# EAGLE design tram.stop (EAGLE 6.5.0)
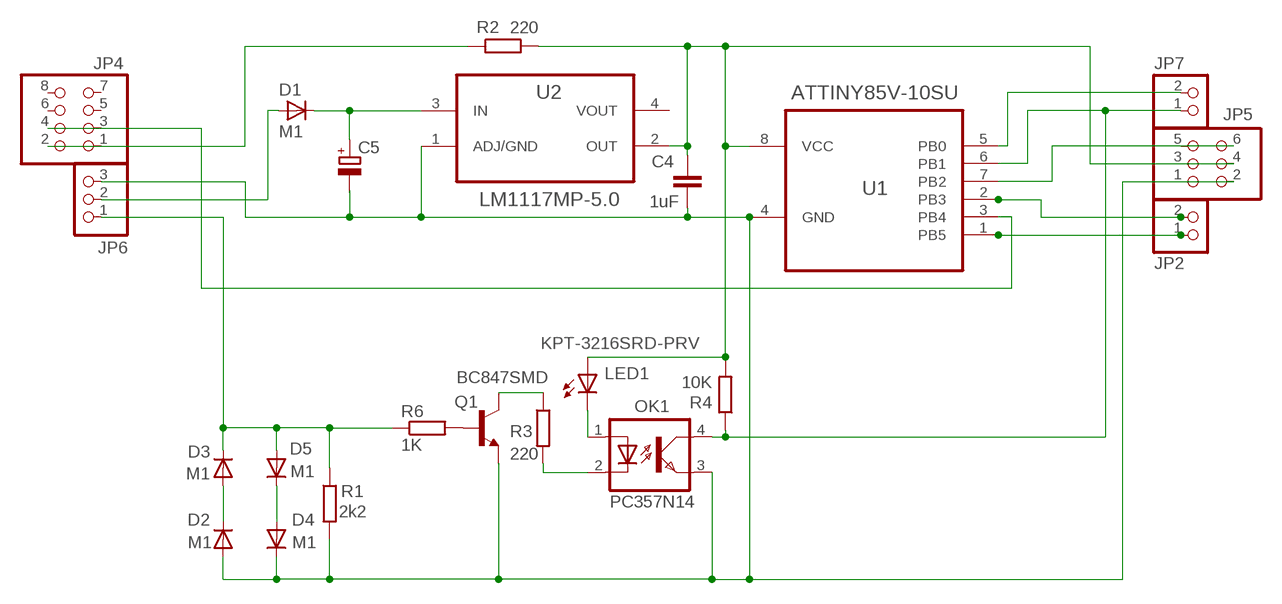
[diagram p0: schematic, sheet 1]

## Parts
C4  1uF  C-EUC0402  [C0402]
C5  CPOL-EUSMCD  [SMC_D]
D1  M1  ES2D  [SMB]
D2  M1  ES2D  [SMB]
D3  M1  ES2D  [SMB]
D4  M1  ES2D  [SMB]
D5  M1  ES2D  [SMB]
JP2  PINHD-1X2/90  [1X02/90]
JP4  PINHD-2X4/90  [2X04/90]
JP5  PINHD-2X3/90  [2X03/90]
JP6  PINHD-1X3/90  [1X03/90]
JP7  PINHD-1X2/90  [1X02/90]
LED1  KPT-3216SRD-PRV  LEDSML1206  [SML1206]
OK1  PC357N14  LTV816S  [SMD4]
Q1  BC847SMD  [SOT23]
R1  2k2  R-EU_R1206  [R1206]
R2  220  R-EU_R1206  [R1206]
R3  220  R-EU_R1206  [R1206]
R4  10K  R-EU_R1206  [R1206]
R6  1K  R-EU_R1206  [R1206]
U1  ATTINY85V-10SU  [SOIC127P798X216-8N]
U2  LM1117MP-5.0  [SOT230P696X180-4N]

## Nets
220: LED1.C OK1.1(A)
JP1: D3.C D5.A JP6.1 R1.1 R6.1
JP2: C4.2 D2.A D4.C JP5.1 JP5.2 JP6.3 OK1.3(EMIT) Q1.2(E) R1.2 U1.4(GND) U2.1(ADJ/GND)
N$1: JP2.1 U1.1(PB5)
N$2: JP2.2 U1.2(PB3)
N$4: D2.C D3.A
N$5: D4.A D5.C
N$6: Q1.1(B) R6.2
N$7: Q1.3(C) R3.1
N$9: OK1.2(C) R3.2
N$10: JP5.5 JP5.6 U1.7(PB2)
N$11: JP7.2 U1.5(PB0)
N$12: JP4.1 JP4.2 R2.1
N$14: JP7.1 OK1.4(COL) R4.1 U1.6(PB1)
N$15: C4.1 JP5.3 JP5.4 LED1.A R2.2 R4.2 U1.8(VCC) U2.2(OUT)
N$21: D1.A JP6.2
N$22: C5.+ D1.C U2.3(IN)
RED2: JP4.3 JP4.4 U1.3(PB4)
Unconnected: C5.- JP4.5 JP4.6 JP4.7 JP4.8 U2.4(VOUT)

## Library data of the parts
C4 = rcl:C-EU: CAPACITOR, European symbol
C5 = rcl:CPOL-EU: POLARIZED CAPACITOR, European symbol
D1-D5 = diode:ES2D: DIODE super fast rectifier, 2 A
JP2 JP7 = pinhead:PINHD-1X2: PIN HEADER
JP4 = pinhead:PINHD-2X4: PIN HEADER
JP5 = pinhead:PINHD-2X3: PIN HEADER
JP6 = pinhead:PINHD-1X3: PIN HEADER
LED1 = led:LED: LED OSRAM: - CHIPLED LG R971, LG N971, LY N971, LG Q971, LY Q971, LO R971, LY R971 LH N974, LH R974 LS Q976, LO Q976, LY Q976 LO Q996 - Hyper CHIPLED LW Q18S LB Q993, LB Q99A, LB R99A - SideLED LS A670, LO A670, LY A670, LG A670, LP A670 LB A673, LV A673, LT A673, LW A673 LH A674 LY A675 LS A676, LA A676, LO A676, LY A676, LW A676 LS A679, LY A679, LG A679 - Hyper Micro SIDELED® LS Y876, LA Y876, LO Y876, LY Y876 LT Y87S - SmartLED LW L88C, LW L88S LB L89C, LB L89S, LG L890 LS L89K, LO L89K, LY L89K LS L896, LA L896, LO L896, LY L896 - TOPLED LS T670, LO T670, LY T670, LG T670, LP T670 LSG T670, LSP T670, LSY T670, LOP T670, LYG T670 LG T671, LOG T671, LSG T671 LB T673, LV T673, LT T673, LW T673 LH T674 LS T676, LA T676, LO T676, LY T676, LB T676, LH T676, LSB T676, LW T676 LB T67C, LV T67C, LT T67C, LS T67K, LO T67K, LY T67K, LW E67C LS E67B, LA E67B, LO E67B, LY E67B, LB E67C, LV E67C, LT E67C LW T67C LS T679, LY T679, LG T679 LS T770, LO T770, LY T770, LG T770, LP T770 LB T773, LV T773, LT T773, LW T773 LH T774 LS E675, LA E675, LY E675, LS T675 LS T776, LA T776, LO T776, LY T776, LB T776 LHGB T686 LT T68C, LB T68C - Hyper Mini TOPLED® LB M676 - Mini TOPLED Santana® LG M470 LS M47K, LO M47K, LY M47K Source: http://www.osram.convergy.de LUXEON: - LUMILED® LXK2-PW12-R00, LXK2-PW12-S00, LXK2-PW14-U00, LXK2-PW14-V00 LXK2-PM12-R00, LXK2-PM12-S00, LXK2-PM14-U00 LXK2-PE12-Q00, LXK2-PE12-R00, LXK2-PE12-S00, LXK2-PE14-T00, LXK2-PE14-U00 LXK2-PB12-K00, LXK2-PB12-L00, LXK2-PB12-M00, LXK2-PB14-N00, LXK2-PB14-P00, LXK2-PB14-Q00 LXK2-PR12-L00, LXK2-PR12-M00, LXK2-PR14-Q00, LXK2-PR14-R00 LXK2-PD12-Q00, LXK2-PD12-R00, LXK2-PD12-S00 LXK2-PH12-R00, LXK2-PH12-S00 LXK2-PL12-P00, LXK2-PL12-Q00, LXK2-PL12-R00 Source: www.luxeon.com KINGBRIGHT: KA-3528ASYC Source: www.kingbright.com
OK1 = optocoupler:LTV816: OPTO COUPLER Source: LITEON, LTV816.pdf; OC_FARNELL: unknown; OC_NEWARK: unknown
Q1 = transistor-npn:BC847*: NPN Transistor
R1-R4 R6 = rcl:R-EU_: RESISTOR, European symbol
U1 = Attiny85:ATTINY85V-10SU: 8-bit Microcontroller with In-System Programmable Flash; MPN: ATTINY85V-10SU; OC_FARNELL: 1455166; OC_NEWARK: 58M3799; PACKAGE: SOIC-8; SUPPLIER: Atmel
U2 = LM1117:LM1117MP-5.0: Linear regulators; MPN: LM1117MP-5.0; OC_FARNELL: 9778209; OC_NEWARK: 41K3471; PACKAGE: SOT223-3; SUPPLIER: NationalSemiconductor

## Board
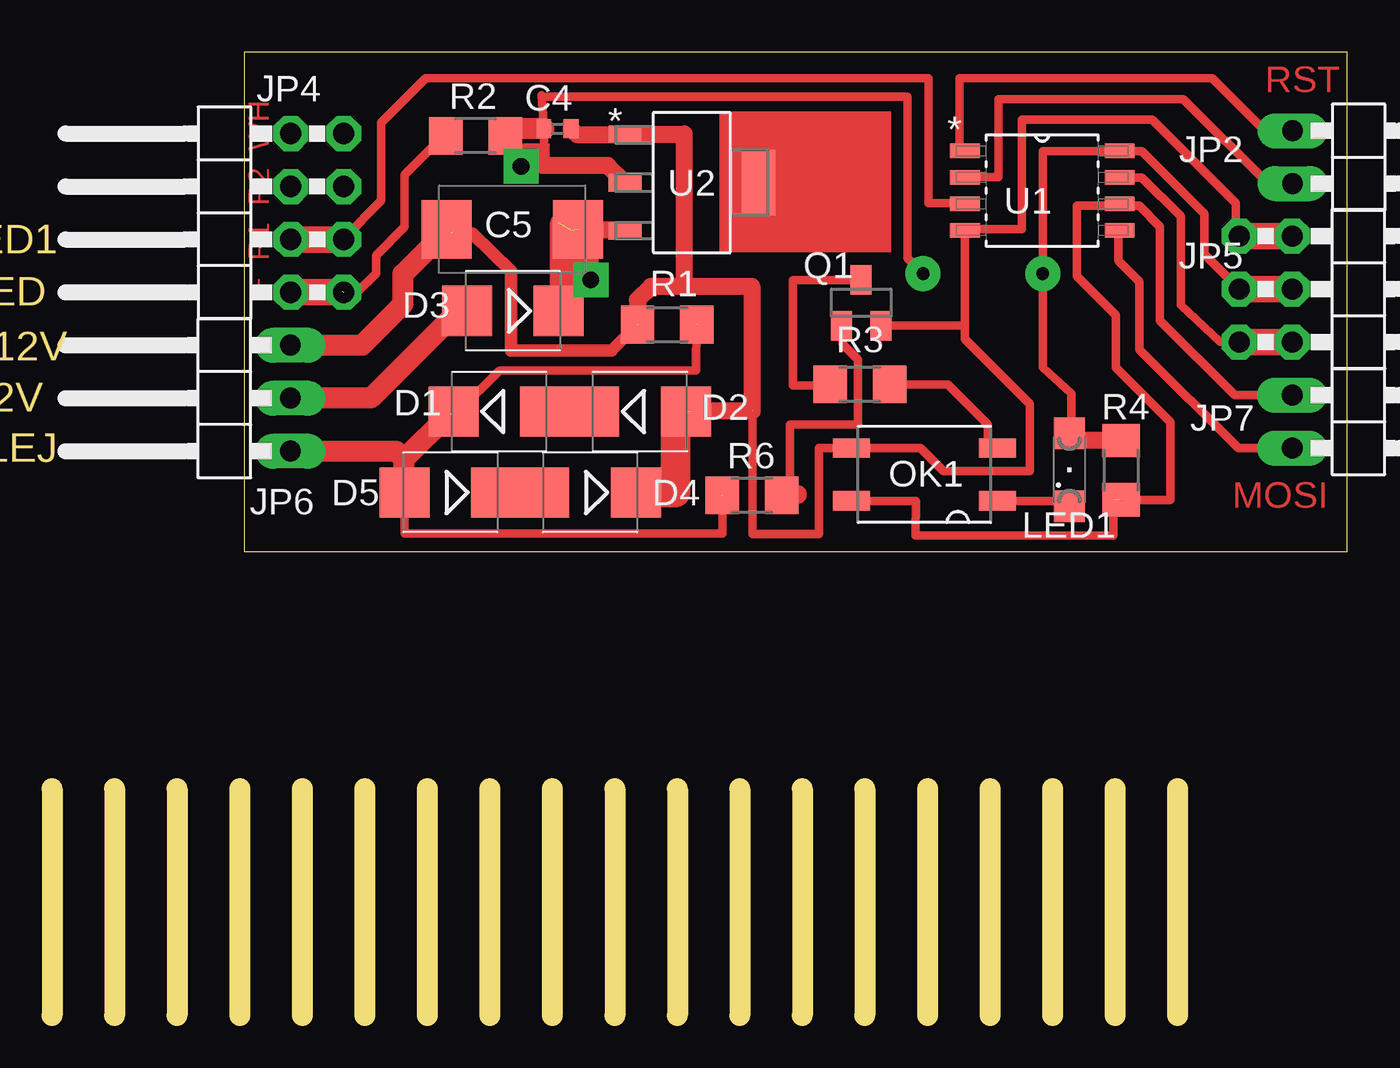
[diagram p1: board, top side]
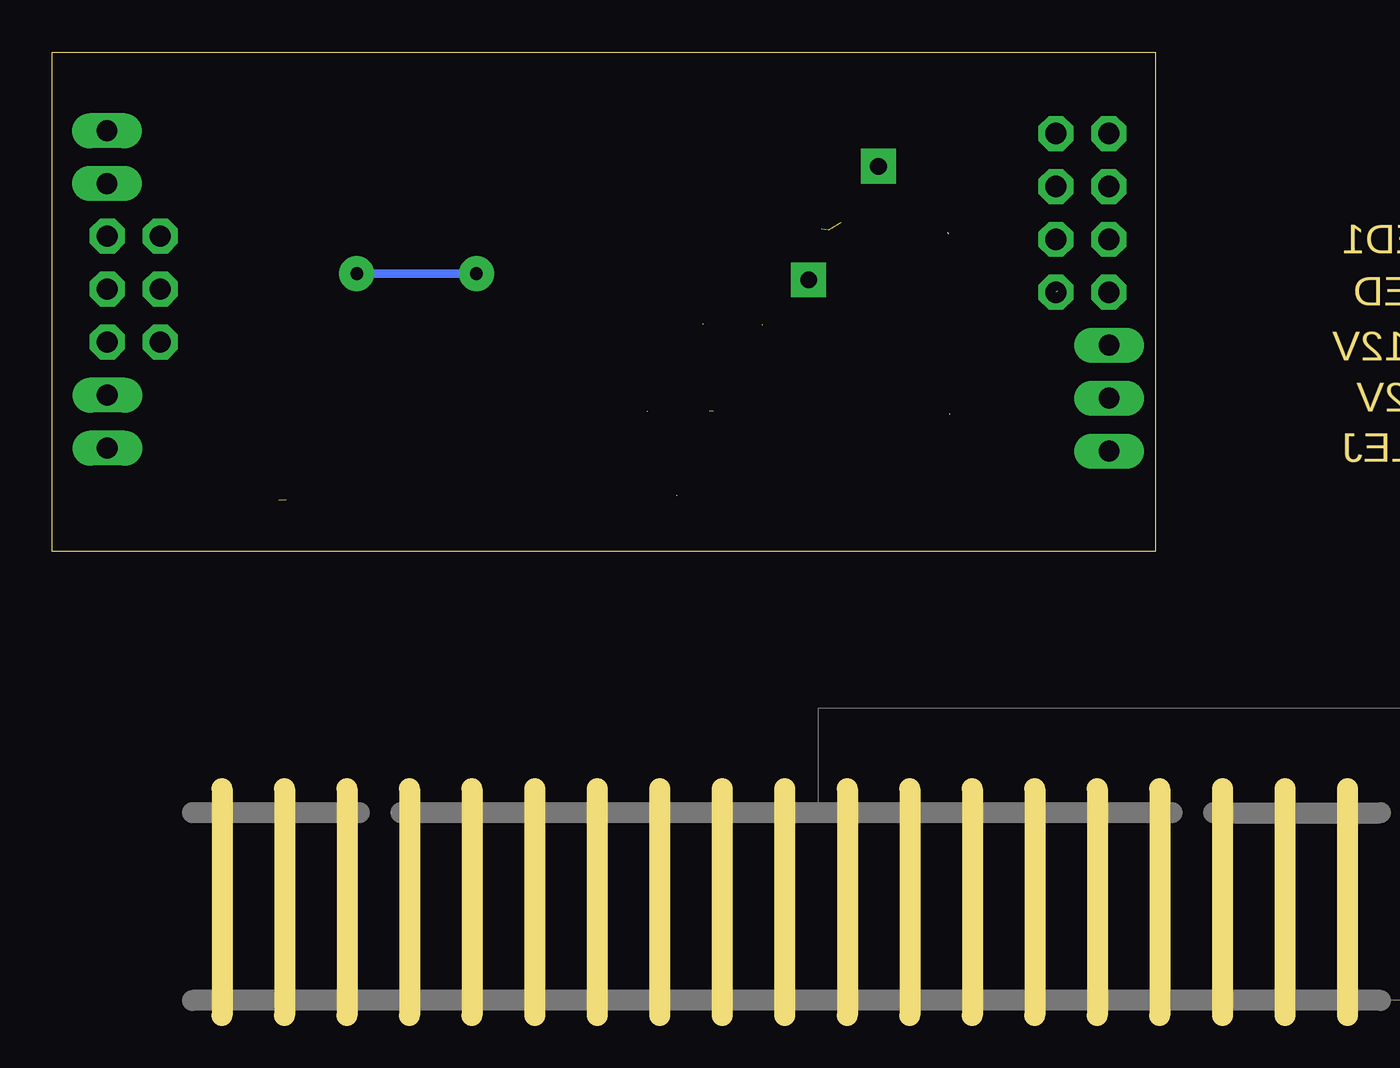
[diagram p2: board, bottom side, seen from below]

Size 62.15 x 46.23 mm. Coordinates in mm from the lower left corner, seen from the top.
Outline: 0,10.88 0,0
Outline: 3,10.88 3,0
Outline: 6,10.88 6,0
Outline: 9,10.88 9,0
Outline: 12,10.88 12,0
Outline: 15,10.88 15,0
Outline: 18,10.88 18,0
Outline: 21,10.88 21,0
Outline: 24,10.88 24,0
Outline: 27,10.88 27,0
Outline: 30,10.88 30,0
Outline: 33,10.88 33,0
Outline: 36,10.88 36,0
Outline: 39,10.88 39,0
Outline: 42,10.88 42,0
Outline: 45,10.88 45,0
Outline: 48,10.88 48,0
Outline: 51,10.88 51,0
Outline: 54,10.88 54,0
Outline: 9.22,22.27 62.15,22.27 62.15,46.23 9.22,46.23 9.22,22.27
Copper layers (1*16): Top 0.035mm / dielectric 1.5mm / Bottom 0.035mm
Design rules "default": minimum track width 10mil, minimum drill 24mil, track to track 8mil, track to pad 8mil, pad to pad 8mil, via to via 8mil, smd to smd 8mil, copper to edge 40mil, drill to drill 8mil, minimum pad ring 10mil, minimum via ring 8mil, stop-mask expansion 4mil, vias tented up to drill 0mil, thermal gap 10mil

### Footprints (pad centres in the part's own frame; a part is rotated, then mirrored left to right if it is on the bottom)
C0402 = smd 0.7 x 0.9: 1 -0.65,0; 2 0.65,0
SMC_D = smd 2.4 x 2.8: + -3.15,0; - 3.15,0
SMB = smd 2.4 x 2.4: A 2.2,0; C -2.2,0
1X02/90 = drill 1 pad 1.676 long: 1 -1.27,-3.81; 2 1.27,-3.81
2X04/90 = drill 1.016 pad 1.676 octagon: 1 -3.81,-6.35; 2 -3.81,-3.81; 3 -1.27,-6.35; 4 -1.27,-3.81; 5 1.27,-6.35; 6 1.27,-3.81; 7 3.81,-6.35; 8 3.81,-3.81
2X03/90 = drill 1 pad 1.676 octagon: 1 -2.54,-6.35; 2 -2.54,-3.81; 3 0,-6.35; 4 0,-3.81; 5 2.54,-6.35; 6 2.54,-3.81
1X03/90 = drill 1 pad 1.676 long: 1 -2.54,-3.81; 2 0,-3.81; 3 2.54,-3.81
SML1206 = smd 1.5 x 1.5: A 1.75,0; C -1.75,0
SMD4 = smd 0.914 x 1.778: 1 -1.27,-3.5; 2 1.27,-3.5; 3 1.27,3.5; 4 -1.27,3.5
SOT23 = smd 1 x 1.4: 1 -0.95,-1.1; 2 0.95,-1.1; 3 0,1.1
R1206 = smd 1.6 x 1.803: 1 -1.422,0; 2 1.422,0
SOIC127P798X216-8N = smd 1.422 x 0.711: 1 -3.708,1.905; 2 -3.708,0.635; 3 -3.708,-0.635; 4 -3.708,-1.905; 5 3.708,-1.905; 6 3.708,-0.635; 7 3.708,0.635; 8 3.708,1.905
SOT230P696X180-4N = smd 1.6 x 0.838: 1 -3.2,2.311; 2 -3.2,0; 3 -3.2,-2.311 | smd 1.6 x 3.099: 4 3.2,0

### Placement (x,y rotation side)
C4  24.25,42.55 0 top
C5  22.08,37.73 180 top
D1  22.11,33.81 180 top
D2  28.21,28.98 0 top
D3  21.46,28.98 0 top
D4  25.81,25.1 180 top
D5  19.11,25.1 180 top
JP2  63.32,41.19 270 top
JP4  7.64,38.51 90 top
JP5  63.31,34.86 270 top
JP6  7.62,29.62 90 top
JP7  63.31,28.5 270 top
LED1  48.81,26.19 90 top
OK1  41.85,25.97 90 top
Q1  38.82,34.2 0 top
R1  29.51,33.16 180 top
R2  20.32,42.21 0 top
R3  38.76,30.28 0 top
R4  51.28,26.16 90 top
R6  33.58,24.96 0 top
U1  47.51,39.58 0 top
U2  30.69,39.96 0 top

### Tracks (layer width: path | path; a pad name or v marks a point on that pad's centre or on a via)
220
  Top 0.406: LED1.C 48.27,24.7 OK1.1
JP1  (3 unrouted)
  Top 0.406: 19.48,28.98 21.46,30.94 30.91,30.94 30.91,33.17 | D5.A 16.92,23.12 32.16,23.12 32.16,24.98 32.15,25
  Top 1.016: 16.9,25.11 16.9,26.7 | 16.9,26.7 19.09,28.89 | JP6.1 16.51,27.09 16.9,26.7
  Top 1.27: D5.A 16.9,25.11 | 19.48,28.98 D3.C 19.1,28.83
JP2  (4 unrouted)
  Top 0.305: 19.39,37.76 19.15,37.52
  Top 0.406: 20.17,37.52 19.15,37.52 | 33.6,29 33.6,23.1 36.79,23.1 36.79,27.23 37.83,27.23 OK1.3 41.66,27.24 42.77,26.13 46.9,26.13 46.91,26.14 46.91,29.35 43.8,32.47 43.8,32.98 | 30.33,35 30.43,34.9 | 57.01,37.39 JP5.1 56.79,37.58 56.79,38.98 52.79,42.98 46.54,42.98 46.54,37.73 43.6,37.73 U1.4 43.8,33.1 | 43.8,33.1 43.8,32.98 | 43.8,32.98 43.79,32.98 | Q1.2 43.79,33.1 43.8,33.1
  Top 0.61: 20.17,37.52 22.01,35.71 22.01,31.9 26.84,31.9 R1.2
  Top 0.813: 33.6,29 32.93,28.99 30.61,28.99 | 33.58,29 33.58,34.99 28.72,34.99 | 29.91,29.01 30.41,29.01 D2.A | 28.72,34.99 28.09,34.35 28.09,33.12 | 28.72,34.99 28.74,35 30.33,35 30.33,42.3 27.51,42.3 U2.1 25.18,42.27 C4.2 | 59.49,37.39 JP5.2
  Top 1.016: JP6.3 14.87,32.16 16.84,34.14 16.84,35.59 18.86,37.6 19.2,37.6
  Top 1.27: 57.01,37.39 59.49,37.39
  Top 1.422: D4.C 29.91,25.1 29.91,29.01
N$1
  Top 0.406: U1.1 43.54,41.49 43.54,44.98 55.66,44.98 58.16,42.48 59.5,42.48 JP2.1
N$2
  Top 0.406: JP2.2 58.34,39.92 54.29,43.98 45.41,43.98 45.41,40.23 43.43,40.23 U1.2
N$4
  Top 0.406: D3.A D2.C
N$5
  Top 0.406: D5.C D4.A
N$6
  Top 0.406: 35.79,25.02 35.41,25.02 35.41,28.35 38.66,28.35 38.66,31.48 37.91,32.23 37.91,33.05 Q1.1
  Top 0.813: R6.2 35.79,24.96 35.79,25.02
N$7
  Top 0.406: Q1.3 35.54,35.3 35.54,30.23 37.34,30.23 R3.1
N$9
  Top 0.406: OK1.2 44.84,27.24 44.91,27.3 44.91,28.35 42.98,30.28 R3.2
N$10
  Top 0.406: U1.7 52.3,40.22 54.16,38.35 54.16,34.1 56.04,32.35 56.94,32.35 JP5.5
  Top 1.27: JP5.5 JP5.6
N$11
  Top 0.406: 60.29,27.21 JP7.2 56.91,27.23 52.23,31.91 52.21,31.91 52.16,31.96 52.16,35.23 51.16,36.23 51.16,37.62 U1.5
N$12  (1 unrouted)
  Top 0.406: 14.03,34.66 JP4.1 14.01,34.73 14.66,34.73 15.54,35.6 15.54,36.48 16.91,37.85 16.91,40.35 18.77,42.21 R2.1
  Top 1.016: 13.85,34.7 13.91,34.76
  Top 1.27: JP4.2 13.85,34.7
N$14  (1 unrouted)
  Top 0.406: OK1.4 41.44,24.7 41.43,23.04 50.91,23.02 50.91,24.4 R4.1 51.3,24.73 53.66,24.73 53.66,28.48 51.04,31.1 51.04,33.6 49.16,35.48 49.16,38.85 50.74,38.85 U1.6 | 50.93,24.75 50.91,24.74 | JP7.1 56.74,29.77 53.16,33.35 53.16,37.85 52.16,38.85 51.31,38.85 U1.6 | U1.6 51.57,38.95
N$15  (via drill 0.6 pad 1.68)
  Top 0.406: 23.66,40.79 23.6,40.85 C4.1 23.47,44.16 23.66,44.1 41.04,44.1 41.04,36.35 v41.79,35.6 | LED1.A 48.91,27.96 48.91,29.85 47.54,31.1 v47.54,35.6 47.54,41.48 50.95,41.48 U1.8 52.28,41.48 55.29,38.48 55.29,36.54 JP5.3
  Top 0.61: 23.6,40.79 23.5,40.69
  Top 0.813: R4.2 48.66,27.59 LED1.A | U2.2 26.66,40.79 23.66,40.79 23.6,40.79
  Top 1.016: C4.1 22.08,42.55 R2.2
  Top 1.27: JP5.3 JP5.4
  Bottom 0.406: v47.54,35.6 v41.79,35.6
N$18  (via drill 0.8 pad 1.68)
  other vias: 22.5,40.75
N$21
  Top 1.016: D1.A 19.47,33.81 15.3,29.64 11.45,29.64 JP6.2
N$22  (2 unrouted)
  Top 0.813: D1.C 24.31,38.05 | U2.3 27.46,37.68 24.9,37.68
N$24  (via drill 0.8 pad 1.68)
  other vias: 25.85,35.3
N$27
  Top 0.813: 25.84,35.81 25.84,37.4
RED2
  Top 0.406: JP4.3 13.99,37.34 14.03,37.34 15.79,39.1 15.79,42.85 17.91,44.98 42.04,44.98 42.04,38.98 43.27,38.98 U1.3
  Top 1.27: JP4.4 JP4.3
(copper drawn outside any net)
  shapes: Top area x3

### Text on the board
Top: RST | + R1 R2 WH | MOSI
Dimension: ČERVENÁ LED1 | +5V LED | KOLEJIŠTĚ, -12V | +12V | IZOLOVANÁ KOLEJ
tDocu: + | 12V | -